# Altium schematic sheet CAM.SchDoc
size A2; SheetNumber: 5; SheetTotal: 8
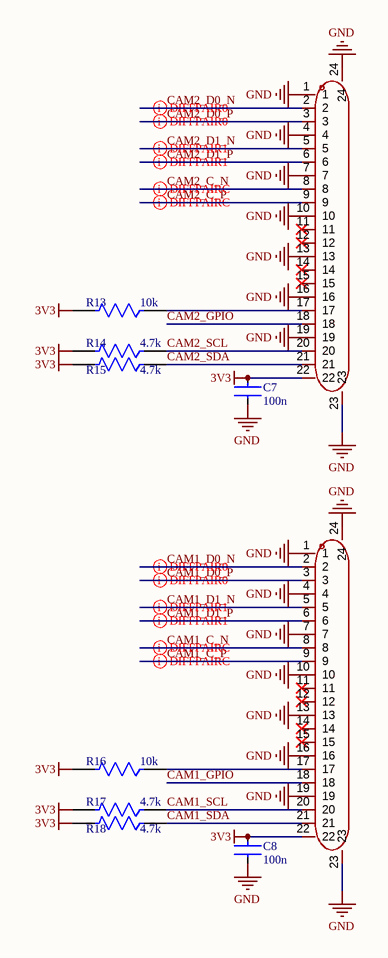
[diagram p0: CAM.SchDoc]

## Parts
C7  100n  [CAP_0402]
C8  100n  [CAP_0402]
J4  05b20l22p  [FLEX_CON_22P]  (value not drawn)
J5  05b20l22p  [FLEX_CON_22P]  (value not drawn)
R13  10k  [RES_0402]
R14  4.7k  [RES_0402]
R15  4.7k  [RES_0402]
R16  10k  [RES_0402]
R17  4.7k  [RES_0402]
R18  4.7k  [RES_0402]

## Nets
3V3: C7.1 C8.1 J4.22 J5.22 R13.2 R14.2 R15.2 R16.2 R17.2 R18.2
GND: C7.2 C8.2 J4.1 J4.4 J4.7 J4.10 J4.13 J4.16 J4.19 J4.23 J4.24 J5.1 J5.4 J5.7 J5.10 J5.13 J5.16 J5.19 J5.23 J5.24
CAM1_C_N: J5.8
CAM1_C_P: J5.9
CAM1_D0_N: J5.2
CAM1_D0_P: J5.3
CAM1_D1_N: J5.5
CAM1_D1_P: J5.6
CAM1_GPIO: J5.18
CAM1_SCL: J5.20 R17.1
CAM1_SDA: J5.21 R18.1
CAM2_C_N: J4.8
CAM2_C_P: J4.9
CAM2_D0_N: J4.2
CAM2_D0_P: J4.3
CAM2_D1_N: J4.5
CAM2_D1_P: J4.6
CAM2_GPIO: J4.18
CAM2_SCL: J4.20 R14.1
CAM2_SDA: J4.21 R15.1
NetJ4_17: J4.17 R13.1
NetJ5_17: J5.17 R16.1

Not connected (* = marked no-connect by the designer): J4 11* 12* 14* 15*; J5 11* 12* 14* 15*

## Layout directives
differential pair; differential pair class CAM0: CAM1_D0_N, CAM1_D0_P, CAM2_D0_N, CAM2_D0_P
differential pair; differential pair class CAM1: CAM1_D1_N, CAM1_D1_P, CAM2_D1_N, CAM2_D1_P
differential pair; differential pair class CAMC: CAM1_C_N, CAM1_C_P, CAM2_C_N, CAM2_C_P

## Library data of the parts
C7 C8 = CMP-03422-001116-1: C307331; Tolerance: 10%; Voltage Rating: 50V; Capacitance: 100nF; Value: 100nF; Max Operating Temperature: 125°C; Case Code (Metric): 1005; RoHS Compliant: Yes; Series: -; Case Code (Imperial): 0402; Min Operating Temperature: -55°C; Mount: Surface Mount; Case/Package: 0402; Packaging: Cut Tape
J4 J5 = 05b20l22p: C22459552; Manufacturer: HanElectricity(瀚源); AddInBom: yes; Locking Feature: Slide Lock; Number of Contacts: 22P; Pitch: 0.5mm; FFC, FCB Thickness: 0.3mm; Rated Voltage (Max): 50V; Current Rating (Max): 400mA; LCSC Part Name: 抽屉式 下接 P数:22P 间距:0.5mm; SupplierPart: C22459552; ManufacturerPart: 05B20L22P; Supplier Footprint: SMD,P=0.5mm,卧贴; JLCPCB Part Class: Extended Part; Datasheet: https://item.szlcsc.com/datasheet/05B20L22P/24136208.html; Supplier: LCSC; ConvertToPcb: yes; SymbolName: 05B20L22P; FootprintName: CONN-SMD_05B20L22P; Contact Type: Bottom Contact; Mounting Type: Surface Mount, Right Angle; Height Above Board: 2mm; Contact Material: Phosphor bronze; Contact Plating: Tin; Operating Temperature: -25℃~+85℃
R13 R16 = CMP-03412-016018-1: C25744; Tolerance: 1%; Temperature Coefficient: 100ppm/°C; Resistance: 10kOhm; Max Power Dissipation: 63mW; Value: 10kOhm; Ratings: AEC-Q200; Resistor Type: Thick Film; Number of Terminations: 2; RoHS Compliant: Yes; Min Operating Temperature: -55°C; Case/Package: 0402; Series: AC; Length: 0.039inch; Width: 0.02inch; Features: Moisture Resistant; Height: 0.015inch; Packaging: Tape and Reel; Max Operating Temperature: 155°C
R14 R15 R17 R18 = CMP-03412-016018-1: C25900; Tolerance: 1%; Temperature Coefficient: 100ppm/°C; Resistance: 4.7kOhm; Max Power Dissipation: 63mW; Value: 4.7kOhm; Ratings: AEC-Q200; Resistor Type: Thick Film; Number of Terminations: 2; RoHS Compliant: Yes; Min Operating Temperature: -55°C; Case/Package: 0402; Series: AC; Length: 0.039inch; Width: 0.02inch; Features: Moisture Resistant; Height: 0.015inch; Packaging: Tape and Reel; Max Operating Temperature: 155°C